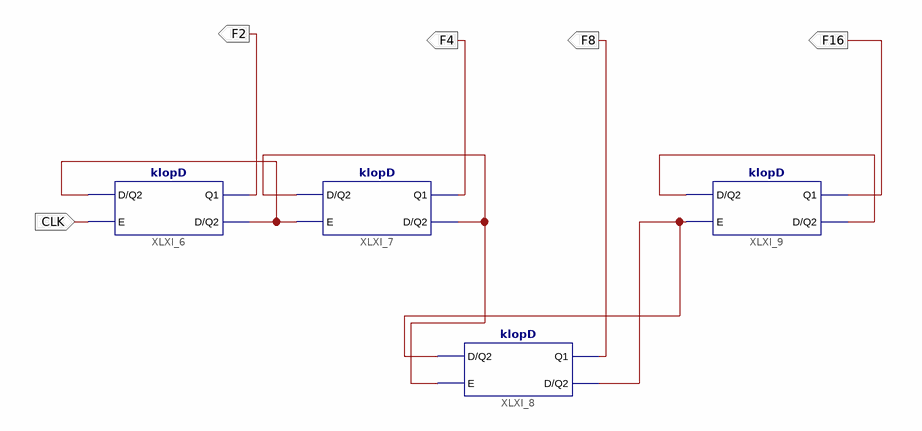
[diagram p0: schematic sheet 1]
// Xilinx ISE schematic delic.sch (spartan3e) as structural Verilog: 4 symbols, 5 ports
module delic (
  input  CLK,
  output F16,
  output F4,
  output F8,
  output F2
);

  wire XLXN_2, XLXN_7, XLXN_9, XLXN_12;

  klopD XLXI_7 (.D(XLXN_2), .E(XLXN_9), .Q1(F4), .Q2(XLXN_2));
  klopD XLXI_9 (.D(XLXN_12), .E(XLXN_7), .Q1(F16), .Q2(XLXN_12));
  klopD XLXI_8 (.D(XLXN_7), .E(XLXN_2), .Q1(F8), .Q2(XLXN_7));
  klopD XLXI_6 (.D(XLXN_9), .E(CLK), .Q1(F2), .Q2(XLXN_9));
endmodule
